# Altium schematic sheet DCAC_V2.SchDoc (part 3 of 3)
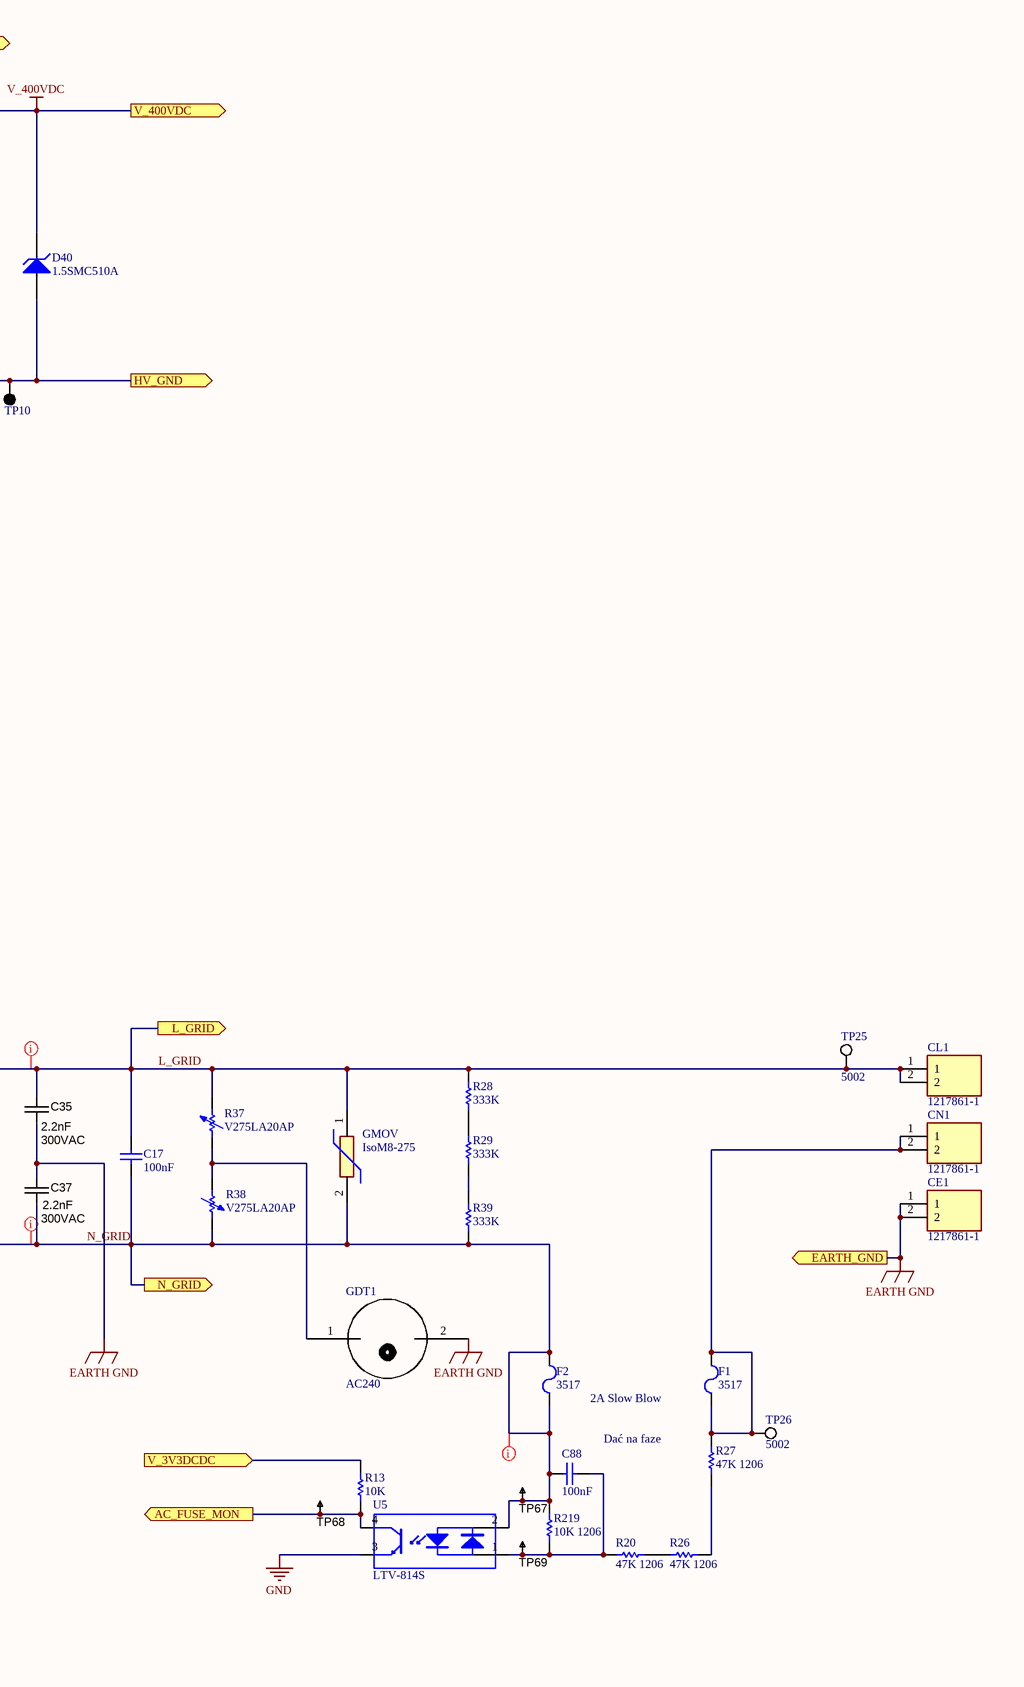
[diagram p3: DCAC_V2.SchDoc, right]

## Library data of the parts (continued)
R28 R29 R39 = CMP-2003-00836-1: Manufacturer: Panasonic; Part Number: ERJ8ENF3303V; Manufacturer Part Number: ERJ-8ENF3303V; Resistance: 330kR; Tolerance: 1%; Temperature Coefficient: 100ppm/°C; Max Power Dissipation: 250mW; Voltage Rating: 200V; Supplier 1: Digi-Key; Supplier Part Number 1: P330KFCT-ND; RoHS: Yes; Category: Chip SMD Resistors; Stock 1: 4299; Pricing 1: 1=0.10000, 10=0.09300, 100=0.03560, 1000=0.01569, 2500=0.01355 (USD); Mount: Surface Mount; Case/Package: 1206; Number of Pins: 2; Case Code (Imperial): 1206; Case Code (Metric): 3216; Contact Plating: Tin; Min Operating Temperature: -55°C; Max Operating Temperature: 155°C; Packaging: Tape and Reel; Resistor Type: Thick Film; Number of Terminations: 2; Series: ERJ; Package Quantity: 5000; Power Rating: 250mW; Termination: SMD/SMT; Resistance Tolerance: 1%; Construction: Rectangular; Technology: THICK FILM; Length: 3.2mm; Width: 1.6mm; Height: 0.6mm; Depth: 1.6mm; Radiation Hardening: No; RoHS Compliant: Yes; REACH SVHC: No SVHC; Military Standard: Not; ComponentLink1URL: https://datasheet.ciiva.com/22673/1678782-22673302.pdf?src-supplier=Element14; ComponentLink1Description: https://datasheet.ciiva.com/22673/1678782-22673302.pdf?src-supplier=Element14; ComponentLink2URL: https://datasheet.ciiva.com/16784/70260748-16784168.pdf?src-supplier=Allied+Electronics; ComponentLink2Description: https://datasheet.ciiva.com/16784/70260748-16784168.pdf?src-supplier=Allied+Electronics; ComponentLink3URL: https://datasheet.ciiva.com/17206/aoa0000ce2-17206269.pdf?src-supplier=Avnet+Europe; ComponentLink3Description: https://datasheet.ciiva.com/17206/aoa0000ce2-17206269.pdf?src-supplier=Avnet+Europe; ComponentLink4URL: https://datasheet.ciiva.com/5915/426256-5915358.pdf?src-supplier=Farnell; ComponentLink4Description: https://datasheet.ciiva.com/5915/426256-5915358.pdf?src-supplier=Farnell
R33 = SBCHE4100RJ: Resistor; Manufacturer_Name: TE Connectivity; Datasheet Link: https://www.mouser.com/datasheet/2/418/NG_DS_1773278_F-724916.pdf; Height: 20mm; Manufacturer_Part_Number: SBCHE4100RJ; Mouser Part Number: N/A; Mouser Price/Stock: https://www.mouser.com/Search/Refine.aspx?Keyword=N%2FA
R37 R38 = CMP-2000-07379-1: Metal-Oxide Varistor, 275 VAC, 450 pF, -55 to 85 degC, 2-Pin THD, RoHS, Tape and Reel; Manufacturer: Littelfuse; RMS Voltage-Max: 275V; Capacitance: 450pF; Rated Voltage: 369V; Peak Output Current: 4500A; Clamping Voltage-Max: 710V; Mounting Technology: ThroughHole; Package Reference: V275LA20AP; Datasheet Version: 11/2015; Datasheet URL: http://www.littelfuse.com/~/media/electronics/datasheets/varistors/littelfuse_varistor_la_datasheet.pdf.pdf; Manufacturer URL: http://www.littelfuse.com/; Package Description: 4-Pin Through Hole Device, Body 17 x 5.6 mm, Pitch 7.5 mm
R43 R48 R50 = RES-2: ±1% 330Ω ±100ppm/℃ 0.1W 0603 Chip Resistor - Surface Mount ROHS; Manufacturer: Yageo; Manufacturer Part Number: RC0603FR-07330RL; Tolerance: 10%; ESR: 800 mohm; Voltage Rating (DC): 16 V; Capacitance: 47 uF; Temperature Coefficient: 100ppm/°C; Power Rating: 100mW; Length: 7.3 mm; ComponentLink1URL: http://www.yageo.com/; Packaging: Tape and Reel; Pins: 2; ComponentLink1Description: Manufacturer URL; Case Code (Imperial): 2917; REACH SVHC: No SVHC; Width: 4.3 mm; ComponentLink2Description: Datasheet; Voltage Rating: 16 V; RoHSCompliant: True; Max Operating Temperature: 125degC; ComponentLink2URL: http://www.yageo.com/documents/recent/PYu-RC_Group_51_RoHS_L_04.pdf; Min Operating Temperature: -55degC; Case/Package: 2917; Radiation Hardening: No; DatasheetVersion: Rev. 4, 02/2016; Mount: Surface Mount; PackageReference: 0603; Package Quantity: 500; Case Code (Metric): 7343; PackageDescription: 2-Pin Surface Mount Device, Body 1.6 x 0.8 mm; Height: 3.1 mm; Supplier 1: Digi-Key; Supplier Part Number 1: 311-330HRCT-ND; RoHS: Yes; Category: Chip SMD Resistors; Stock 1: 4209654; Pricing 1: 1=0.10000, 10=0.02300, 100=0.00940, 1000=0.00421, 2500=0.00366 (USD); Number of Pins: 2; Composition: Thick Film; Resistance: 330R; Number of Terminations: 2; Max Power Dissipation: 100mW; Termination: SMD/SMT; Features: Moisture Resistant; Depth: 0.8mm; Lead Free: Lead Free; ComponentLink3URL: https://datasheet.ciiva.com/11819/0900766b80f96399-11819327.pdf?src-supplier=RSComponents; ComponentLink3Description: https://datasheet.ciiva.com/11819/0900766b80f96399-11819327.pdf?src-supplier=RSComponents; ComponentLink4URL: https://datasheet.ciiva.com/2454/pyu-r-int-thick-7-2454864.pdf?src-supplier=Digi-Key; ComponentLink4Description: https://datasheet.ciiva.com/2454/pyu-r-int-thick-7-2454864.pdf?src-supplier=Digi-Key; ComponentLink5URL: https://datasheet.ciiva.com/2454/pyu-r-int-thick-7-2454865.pdf?src-supplier=Digi-Key; ComponentLink5Description: https://datasheet.ciiva.com/2454/pyu-r-int-thick-7-2454865.pdf?src-supplier=Digi-Key; ComponentLink6URL: https://datasheet.ciiva.com/2454/pyu-r-int-thick-7-2454866.pdf?src-supplier=Digi-Key; ComponentLink6Description: https://datasheet.ciiva.com/2454/pyu-r-int-thick-7-2454866.pdf?src-supplier=Digi-Key; ComponentLink7URL: https://datasheet.ciiva.com/12555/rc0603-272842-12555334.pdf?src-supplier=Mouser; ComponentLink7Description: https://datasheet.ciiva.com/12555/rc0603-272842-12555334.pdf?src-supplier=Mouser; ComponentLink8URL: https://datasheet.ciiva.com/46440/1868787-46440904.pdf?src-supplier=Element14; ComponentLink8Description: https://datasheet.ciiva.com/46440/1868787-46440904.pdf?src-supplier=Element14; ComponentLink9URL: https://datasheet.ciiva.com/7746/443971-7746329.pdf?src-supplier=Element14; ComponentLink9Description: https://datasheet.ciiva.com/7746/443971-7746329.pdf?src-supplier=Element14; ComponentLink10URL: https://datasheet.ciiva.com/7746/443971-7746330.pdf?src-supplier=Element14; ComponentLink10Description: https://datasheet.ciiva.com/7746/443971-7746330.pdf?src-supplier=Element14; ComponentLink11URL: https://datasheet.ciiva.com/7746/1686128-7746331.pdf?src-supplier=Element14; ComponentLink11Description: https://datasheet.ciiva.com/7746/1686128-7746331.pdf?src-supplier=Element14; Parameter 1: *; JLCPCB Part #: C23138
R152 = CMP-2000-00841-1: Part Number: ERJ-3RQF1R0V; Manufacturer: Panasonic; Tolerance: 1%; Temperature Coefficient: 200ppm/°C; Power Rating: 100mW; Supplier 1: Digi-Key; Supplier Part Number 1: P1.0AJCT-ND; Manufacturer Part Number: ERJ-3RQF1R0V; RoHS: Yes; Category: Chip SMD Resistors; Stock 1: 180732; Pricing 1: 1=0.16000, 10=0.13600, 25=0.09920, 50=0.07200, 100=0.05330, 250=0.04092, 500=0.03224, 1000=0.02232 (USD); Mount: Surface Mount; Case/Package: 0603; Number of Pins: 2; Case Code (Imperial): 0603; Case Code (Metric): 1608; Contact Plating: Tin; Weight: 7.1E-05oz; Size Code: 0603; Min Operating Temperature: -55°C; Max Operating Temperature: 125°C; Packaging: Tape and Reel; Resistance: 1R; Series: ERJ; Resistor Type: Thick Film; Package Quantity: 5000; Termination: SMD/SMT; Number of Terminations: 2; Max Power Dissipation: 100mW; Construction: Rectangular; Resistance Tolerance: 1%; Technology: THICK FILM; Length: 1.6mm; Width: 0.8mm; Height: 0.45mm; Depth: 0.8mm; Radiation Hardening: No; RoHS Compliant: Yes; Lead Free: Lead Free; REACH SVHC: No SVHC; Military Standard: Not; ComponentLink1URL: https://datasheet.ciiva.com/11810/0900766b80eefa12-11810728.pdf?src-supplier=RSComponents; ComponentLink1Description: https://datasheet.ciiva.com/11810/0900766b80eefa12-11810728.pdf?src-supplier=RSComponents; ComponentLink2URL: https://datasheet.ciiva.com/16396/aoa0000ce3-16396837.pdf?src-supplier=Future+Electronics; ComponentLink2Description: https://datasheet.ciiva.com/16396/aoa0000ce3-16396837.pdf?src-supplier=Future+Electronics; ComponentLink3URL: https://datasheet.ciiva.com/28691/391509-28691973.pdf?src-supplier=Element14; ComponentLink3Description: https://datasheet.ciiva.com/28691/391509-28691973.pdf?src-supplier=Element14; ComponentLink4URL: https://datasheet.ciiva.com/16784/70068852-16784839.pdf?src-supplier=Allied+Electronics; ComponentLink4Description: https://datasheet.ciiva.com/16784/70068852-16784839.pdf?src-supplier=Allied+Electronics; ComponentLink5URL: https://datasheet.ciiva.com/9117/aoa0000ce3-9117368.pdf?src-supplier=Avnet; ComponentLink5Description: https://datasheet.ciiva.com/9117/aoa0000ce3-9117368.pdf?src-supplier=Avnet; ComponentLink6URL: https://datasheet.ciiva.com/24165/aoa0000ce3-72189-24165336.pdf?src-supplier=Mouser; ComponentLink6Description: https://datasheet.ciiva.com/24165/aoa0000ce3-72189-24165336.pdf?src-supplier=Mouser; ComponentLink7URL: https://datasheet.ciiva.com/30060/6aoa0000ce3-30060648.pdf?src-supplier=Onlinecomponents.com; ComponentLink7Description: https://datasheet.ciiva.com/30060/6aoa0000ce3-30060648.pdf?src-supplier=Onlinecomponents.com; ComponentLink8URL: https://datasheet.ciiva.com/6138/391509-6138777.pdf?src-supplier=Farnell; ComponentLink8Description: https://datasheet.ciiva.com/6138/391509-6138777.pdf?src-supplier=Farnell; ComponentLink9URL: https://datasheet.ciiva.com/16766/70068852-16766778.pdf?src-supplier=Allied+Electronics; ComponentLink9Description: https://datasheet.ciiva.com/16766/70068852-16766778.pdf?src-supplier=Allied+Electronics; ComponentLink10URL: https://datasheet.ciiva.com/16853/aoa0000ce3-16853436.pdf?src-supplier=Avnet+Europe; ComponentLink10Description: https://datasheet.ciiva.com/16853/aoa0000ce3-16853436.pdf?src-supplier=Avnet+Europe; ComponentLink11URL: https://datasheet.ciiva.com/43455/391509-43455868.pdf?src-supplier=Farnell; ComponentLink11Description: https://datasheet.ciiva.com/43455/391509-43455868.pdf?src-supplier=Farnell; ComponentLink12URL: https://datasheet.ciiva.com/28547/391509-28547230.pdf?src-supplier=Element14; ComponentLink12Description: https://datasheet.ciiva.com/28547/391509-28547230.pdf?src-supplier=Element14
R218 R219 = CMP-2003-00835-1: ±1% ±100ppm/℃ 0.25W 10kΩ 1206 Chip Resistor - Surface Mount ROHS; Manufacturer: Panasonic; Part Number: ERJ8ENF3302V; Manufacturer Part Number: ERJ-8ENF3302V; Resistance: 33kR; Temperature Coefficient: 100ppm/°C; Power Rating: 250mW; Voltage Rating: 200V; Supplier 1: Newark; Supplier Part Number 1: 73AC7929; RoHS: Yes; Category: Chip SMD Resistors; Stock 1: 95000; Pricing 1: 5000=0.01400, 10000=0.01300 (USD); Mount: Surface Mount; Case/Package: 1206; Number of Pins: 2; Case Code (Metric): 3216; Case Code (Imperial): 1206; Contact Plating: Tin; Weight: 0.000571oz; Min Operating Temperature: -55°C; Max Operating Temperature: 155°C; Tolerance: 1%; Packaging: Tape and Reel; Resistor Type: Thick Film; Series: ERJ; Number of Terminations: 2; Max Power Dissipation: 250mW; Construction: Rectangular; Termination: SMD/SMT; Resistance Tolerance: 1%; Technology: THICK FILM; Length: 3.2mm; Width: 0.063inch; Height: 0.6mm; Depth: 1.6mm; Radiation Hardening: No; RoHS Compliant: Yes; Military Standard: Not; REACH SVHC: No SVHC; ComponentLink1URL: https://datasheet.ciiva.com/7802/1678782-7802698.pdf?src-supplier=Element14; ComponentLink1Description: https://datasheet.ciiva.com/7802/1678782-7802698.pdf?src-supplier=Element14; ComponentLink2URL: https://datasheet.ciiva.com/22687/1678782-22687084.pdf?src-supplier=Element14; ComponentLink2Description: https://datasheet.ciiva.com/22687/1678782-22687084.pdf?src-supplier=Element14; ComponentLink3URL: https://datasheet.ciiva.com/9190/aoa0000ce2-9190686.pdf?src-supplier=Avnet; ComponentLink3Description: https://datasheet.ciiva.com/9190/aoa0000ce2-9190686.pdf?src-supplier=Avnet; ComponentLink4URL: https://datasheet.ciiva.com/7802/426256-7802463.pdf?src-supplier=Element14; ComponentLink4Description: https://datasheet.ciiva.com/7802/426256-7802463.pdf?src-supplier=Element14; ComponentLink5URL: https://datasheet.ciiva.com/16758/70260748-16758335.pdf?src-supplier=Allied+Electronics; ComponentLink5Description: https://datasheet.ciiva.com/16758/70260748-16758335.pdf?src-supplier=Allied+Electronics; ComponentLink6URL: https://datasheet.ciiva.com/24168/aoa0000ce2-24168303.pdf?src-supplier=Mouser; ComponentLink6Description: https://datasheet.ciiva.com/24168/aoa0000ce2-24168303.pdf?src-supplier=Mouser; ComponentLink7URL: https://datasheet.ciiva.com/30215/aoa0000ce2-30215919.pdf?src-supplier=Onlinecomponents.com; ComponentLink7Description: https://datasheet.ciiva.com/30215/aoa0000ce2-30215919.pdf?src-supplier=Onlinecomponents.com; ComponentLink8URL: https://datasheet.ciiva.com/46436/1678782-46436639.pdf?src-supplier=Element14; ComponentLink8Description: https://datasheet.ciiva.com/46436/1678782-46436639.pdf?src-supplier=Element14; JLCPCB Part #: C17902
Rcsn1-Rcsn3 RcsnHV = FCSL32R010FER: Resistors FCSL Series Metal Foil Power Rating 1.5W Tape Reel Resistance 20 mOhms; Manufacturer_Name: Ohmite; Manufacturer_Part_Number: FCSL32R020FER; Datasheet Link: https://www.mouser.com/datasheet/2/303/res_fcsl-1265567.pdf; Height: 0.8mm; Mouser Part Number: 588-FCSL32R020FER; Mouser Price/Stock: https://www.mouser.co.uk/ProductDetail/Ohmite/FCSL32R010FER?qs=y6ZabgHbY%252Bzyqz46BACxrg%3D%3D; Supplier 1: Digi-Key; Supplier Part Number 1: FCSL32R020FERCT-ND; Manufacturer: Ohmite; Manufacturer Part Number: FCSL32R020FER; RoHS: Yes; Category: Chip SMD Resistors; Stock 1: 1940; Pricing 1: 1=0.63000, 10=0.45000, 25=0.35120, 50=0.29700, 100=0.23400, 250=0.19800, 500=0.16200, 1000=0.12600 (USD); ComponentLink1URL: http://www.farnell.com/datasheets/2645666.pdf?src-supplier=Farnell; ComponentLink1Description: http://www.farnell.com/datasheets/2645666.pdf?src-supplier=Farnell
T2 = TI-ETD39-200V-2A-LLC: Lr=1.9uH / Lm=10.2uH / n=5.7 / Vin=30-40V / Vout=200V
TP7 TP25 TP26 = CMP-2000-05182-1: Test Point, White, 1-Pin THD, RoHS, Bulk; Manufacturer: KeystoneElectronics; Outside Diameter: 2.54mm; Plating: Silver; Mounting Hole Size: 1mm; Product: TestPoints; Packaging: Bulk; Manufacturer URL: http://www.keyelco.com/; Length: 7.62mm; Datasheet Version: Rev. G, 12/2008; Type: Miniature; Product Category: CircuitBoardHardware-PCB; Material: Nylon; RoHS: True; Contact Material: PhosphorBronze; Datasheet URL: https://ciiva.com/datasheet-click-2917627?src=ciiva&sig=bd195616; Color: White; Brand: KeystoneElectronics
TP9 TP10 = CMP-2000-05181-1: Test Point, Black, 1-Pin THD, RoHS, Bulk; Manufacturer: Keystone; Other Names: 5001K; Catalog Drawings: 5000Series; Alternate Color: 5004K-ND / -TESTPOINTPCMINI.040"DYELLOW / 5003K-ND / -TESTPOINTPCMINI.040"DORANGE / 5002K-ND / -TESTPOINTPCMINI.040"DWHITE / 5000K-ND / -TESTPOINTPCMINI.040"DRED; Kits: DKTGRS232C-KIT-ND / -TTLCONVERTER; Online Catalog: ColorCodedTestPoints; Datasheet URL: https://ciiva.com/datasheet-click-2917627?src=ciiva&sig=bd195616; Mounting Type: 0.040"(1.02mm)HoleDiameter; Family: TestPoints; RoHS Information: RoHSComplianceStatement; Datasheet Version: Rev. G, 12/2008; Color: Black; Category: TestandMeasurement; Standard Package: 100; Manufacturer URL: http://www.keyelco.com/; Material: Base,Nylon46,UL94V-0; Type: PCTestPoint,Miniature; Terminal: 0.010"x0.020"(0.25mmx0.51mm)PhosphorBronzeWire,SilverPlated; Series: THM; Packaging: Bulk
TP63-TP70 = TESTPOINT: SMD test pin
U1 U5 = LTV-814S: 5000Vrms Transistor Output Optocouplers SMD-4 Optocouplers - Phototransistor Output ROHS; Manufacturer: Vishay Lite-On; Manufacturer Part Number: LTV-816S-TA1; Number of Channels: 1; Max Output Voltage: 80V; Forward Voltage: 1.4V; Output Current per Channel: 50mA; Collector-emitter Voltage-Max: 200mV; Rise Time: 18000ns; Input Type: DC; Max Power Dissipation: 200mW; Current Transfer Ratio: 320%; Isolation Voltage: 5kV; Reverse Breakdown Voltage: 6V; Supplier 1: Mouser; RoHS: Yes; Category: Optocouplers; Stock 1: 373; Pricing 1: 1=0.22000, 10=0.19900, 50=0.19900, 100=0.18000, 1000=0.12500, 10000=0.09700 (USD); Mount: Surface Mount; Case/Package: SMD/SMT; Number of Pins: 4; Min Operating Temperature: -50°C; Max Operating Temperature: 110°C; Packaging: Tape and Reel; Collector Emitter Voltage (VCEO): 80V; Series: -; Output Voltage: 80V; Number of Circuits: 1; Forward Current: 50mA; Package Quantity: 1000; Collector Emitter Saturation Voltage: 200mV; Max Collector Current: 50mA; Number of Elements: 1; Power Dissipation: 200mW; Max Input Current: 50mA; Fall Time: 18000ns; Isolation Voltage-Max: 5kV; Radiation Hardening: No; RoHS Compliant: Yes; Lead Free: Lead Free; ComponentLink1URL: https://datasheet.ciiva.com/15119/getdatasheetpartid-317372-15119066.pdf?src-supplier=Verical; ComponentLink1Description: https://datasheet.ciiva.com/15119/getdatasheetpartid-317372-15119066.pdf?src-supplier=Verical; ComponentLink2URL: https://datasheet.ciiva.com/6573/s-110-ltv-816826846m-s-s-ta-s-ta1-s-tpseries-6573991.pdf?src-supplier=Digi-Key; ComponentLink2Description: https://datasheet.ciiva.com/6573/s-110-ltv-816826846m-s-s-ta-s-ta1-s-tpseries-6573991.pdf?src-supplier=Digi-Key; ComponentLink3URL: https://datasheet.ciiva.com/6573/s-110-ltv-816826846m-s-s-ta-s-ta1-s-tpseries-6573992.pdf?src-supplier=Digi-Key; ComponentLink3Description: https://datasheet.ciiva.com/6573/s-110-ltv-816826846m-s-s-ta-s-ta1-s-tpseries-6573992.pdf?src-supplier=Digi-Key; ComponentLink4URL: https://datasheet.ciiva.com/6573/s-110-ltv-816826846m-s-s-ta-s-ta1-s-tpseries-6573993.pdf?src-supplier=Digi-Key; ComponentLink4Description: https://datasheet.ciiva.com/6573/s-110-ltv-816826846m-s-s-ta-s-ta1-s-tpseries-6573993.pdf?src-supplier=Digi-Key; Supplier Part Number 1: 859-LTV-816S-TA1; JLCPCB Part #: C106900
U2 = CMP-0187-00454-2: 2.8 MHz, 150 Î¼A Op Amp, 5-Pin SOT-23, Extended Temperature Range, Tape and Reel; Code_IPC: SOT23-5; PackageDescription: 5-Lead Plastic Small Outline Transistor (OT) [SOT-23]; PackageReference: SOT-23-OT5; ComponentLink3URL: http://www.microchip.com/stellent/groups/techpub_sg/documents/packagingspec/en012702.pdf; ComponentLink1Description: Manufacturer URL; ComponentLink2URL: http://ww1.microchip.com/downloads/en/DeviceDoc/22145a.pdf; ComponentLink2Description: Datasheet; PackageVersion: revBB, Aug-2009; RevisionNote: URLs added.; ComponentLink1URL: http://www.microchip.com/; DatasheetVersion: revA, Mar-2009; ComponentLink3Description: Package Specification